# EAGLE design expansion_module_microSD (EAGLE 9.6.2)
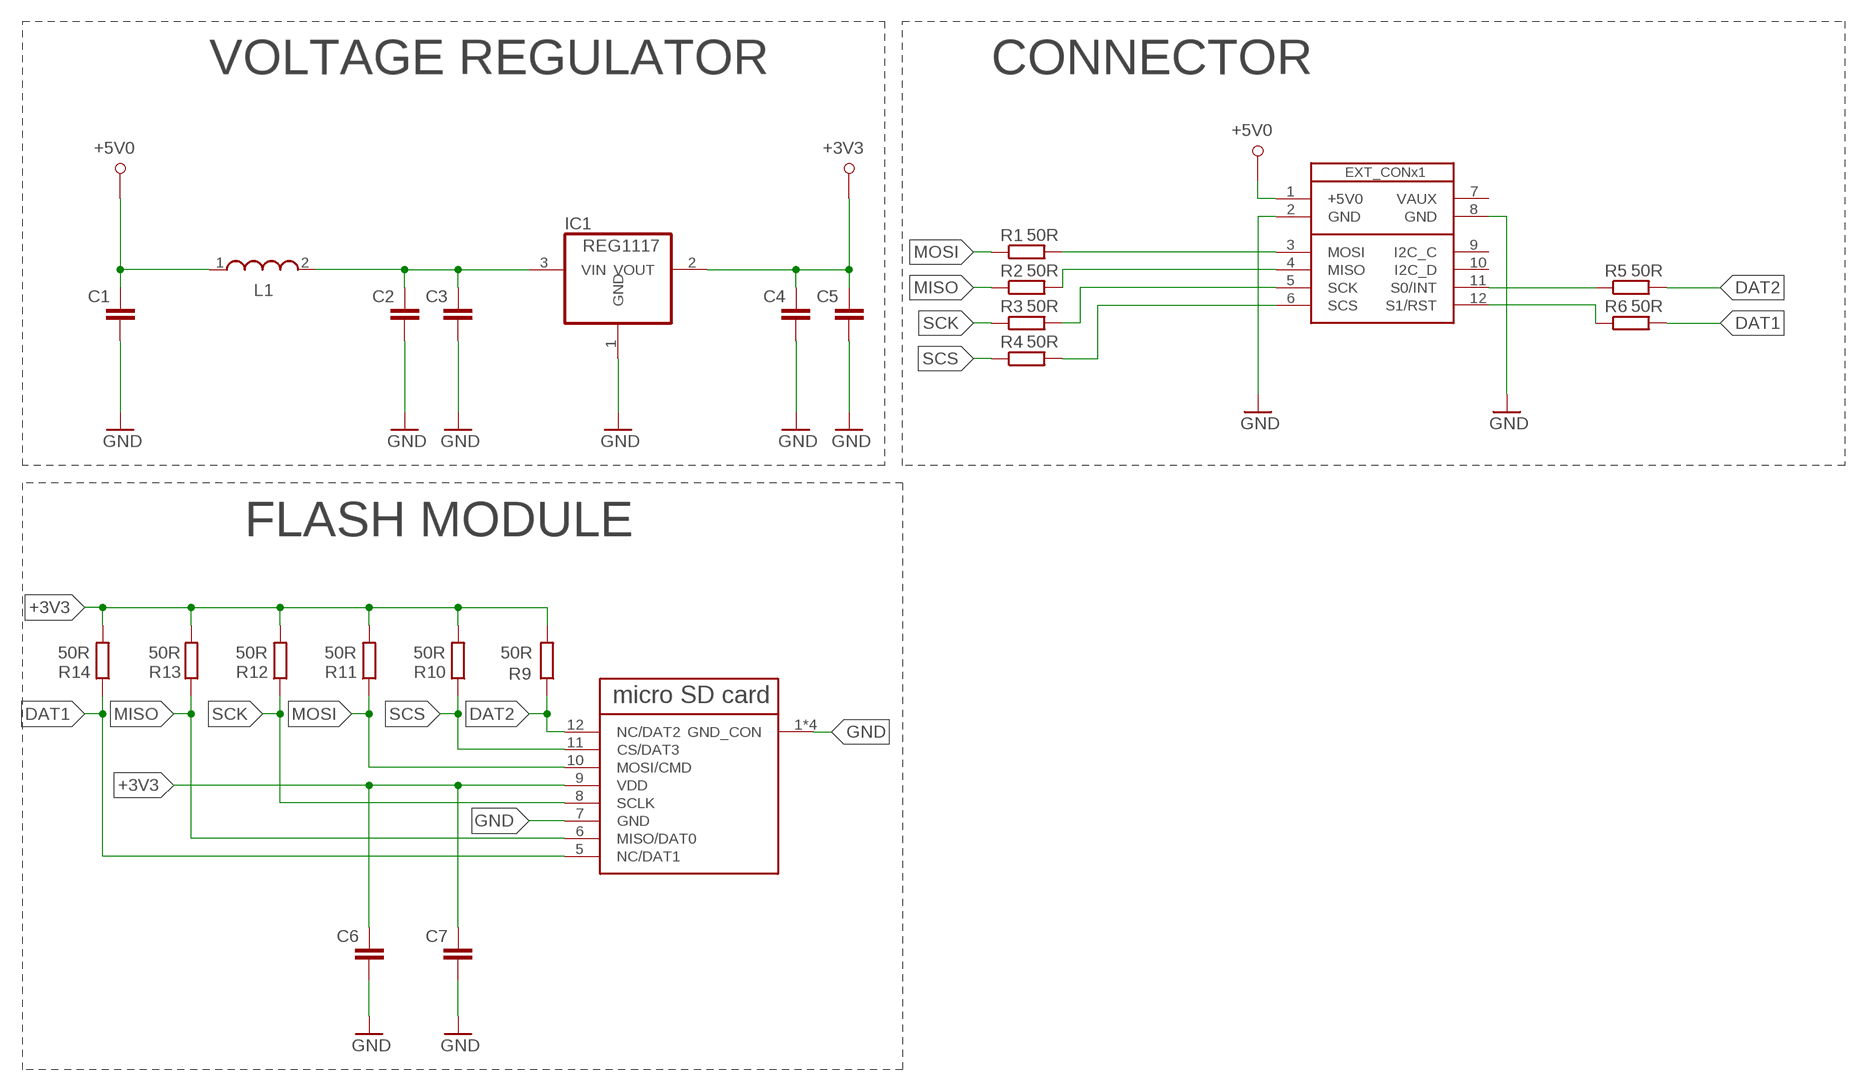
[diagram p0: schematic, sheet 1]

## Parts
C1  C-EUC0805  [C0805]
C2  C-EUC0805  [C0805]
C3  C-EUC0805  [C0805]
C4  C-EUC0805  [C0805]
C5  C-EUC0805  [C0805]
C6  C-EUC0805  [C0805]
C7  C-EUC0805  [C0805]
IC1  REG1117  [SOT223]
L1  WE-LQ_1210  [WE-LQ_M]
MICRO_SD_CARD  MX5009010801  [MX5009010801]
R1  50R  R-EU_R0805  [R0805]
R2  50R  R-EU_R0805  [R0805]
R3  50R  R-EU_R0805  [R0805]
R4  50R  R-EU_R0805  [R0805]
R5  50R  R-EU_R0805  [R0805]
R6  50R  R-EU_R0805  [R0805]
R9  50R  R-EU_R0805  [R0805]
R10  50R  R-EU_R0805  [R0805]
R11  50R  R-EU_R0805  [R0805]
R12  50R  R-EU_R0805  [R0805]
R13  50R  R-EU_R0805  [R0805]
R14  50R  R-EU_R0805  [R0805]
U$1  SB_EXT_CON_X1_SPI  [SB_EXT_CON_X1_FULL]

## Nets
+3V3: C4.2 C5.2 C6.2 C7.2 IC1.2(VOUT) MICRO_SD_CARD.9(VDD) R9.2 R10.2 R11.2 R12.2 R13.2 R14.2
+5V0: C1.2 L1.1 U$1.1(+5V0)
DAT1: MICRO_SD_CARD.5(NC/DAT1) R6.2 R14.1
DAT2: MICRO_SD_CARD.12(NC/DAT2) R5.2 R9.1
GND: C1.1 C2.1 C3.1 C4.1 C5.1 C6.1 C7.1 IC1.1(GND) MICRO_SD_CARD.1(GND_CON) MICRO_SD_CARD.2(GND_CON) MICRO_SD_CARD.3(GND_CON) MICRO_SD_CARD.4(GND_CON) MICRO_SD_CARD.7(GND) U$1.2(GND) U$1.8(GND)
MISO: MICRO_SD_CARD.6(MISO/DAT0) R2.1 R13.1
MOSI: MICRO_SD_CARD.10(MOSI/CMD) R1.1 R11.1
N$1: R1.2 U$1.3(MOSI)
N$2: R2.2 U$1.4(MISO)
N$3: R3.2 U$1.5(SCK)
N$4: R4.2 U$1.6(SCS)
N$5: R5.1 U$1.11(S0/INT)
N$6: R6.1 U$1.12(S1/RST)
N$8: C2.2 C3.2 IC1.3(VIN) L1.2
SCK: MICRO_SD_CARD.8(SCLK) R3.1 R12.1
SCS: MICRO_SD_CARD.11(CS/DAT3) R4.1 R10.1
Unconnected: U$1.7(VAUX) U$1.9(I2C_C) U$1.10(I2C_D)

## Notes on the sheet
- VOLTAGE REGULATOR | CONNECTOR
- FLASH MODULE

## Library data of the parts
C1-C7 = resistor:C-EU: CAPACITOR, European symbol
IC1 = burr-brown:REG1117: 800mA and 1A Low Dropout (LDO) Positive Regulator 1.8V, 2.5V, 2.85V, 3.3V, 5V, and Adj; MPN: REG1117; OC_FARNELL: 1097566; OC_NEWARK: 14P6981
L1 = EagleLibrary_Wuerth_Elektronik_eiSos_rev16a:WE-LQ: SMD Inductor Characteristics Miniature chip inductor wound on a special ferrite core Small inductances for compact circuits High Q at high frequencies Low DC-resistance Operating temperature: –40 ºC to +125 ºC Applications Low power DC/DC-converters from Linear Technology, National Semiconductor, Texas Instruments, Fairchild Semiconductor, ON Semiconductor, STMicroelectronics, Maxim, MPS, Semtech, Exar, Analogic Tech, Diodes and Cologne Chip EMI-Filtering RF-circuits <http://katalog.we-online.de/media/images/eisos/IndLQ_pf2.jpg> Details see: http://katalog.we-online.de/en/pbs/WE-LQ? Updated by Dan Xu 2014-07-08 2014 (C) Wurth Elektronik
MICRO_SD_CARD = micro_SD_card:MX5009010801
R1-R6 R9-R14 = resistor:R-EU_: RESISTOR, European symbol
U$1 = al_smartboard:SB_EXT_CON_X1_SPI

## Net classes
0 default: clearance 0.205 mm

## Board
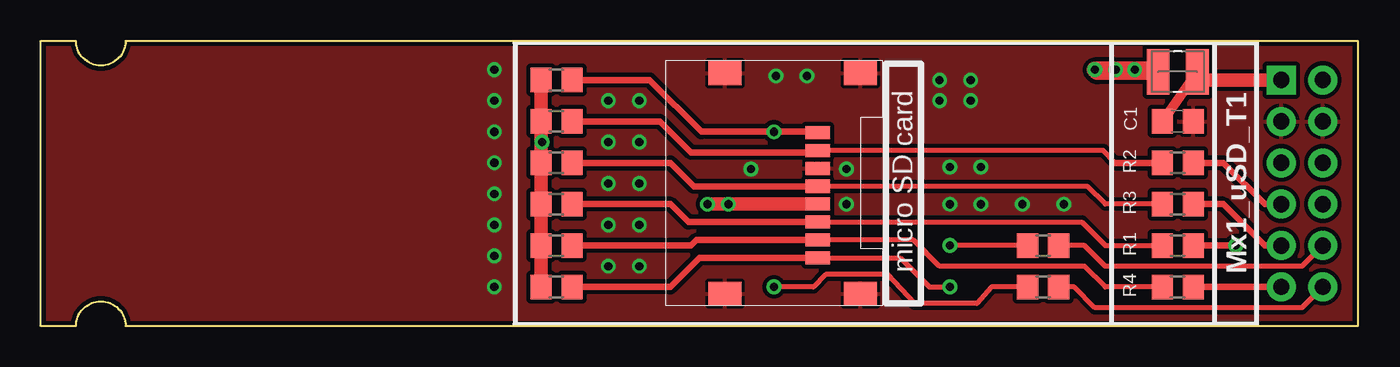
[diagram p1: board, top side]
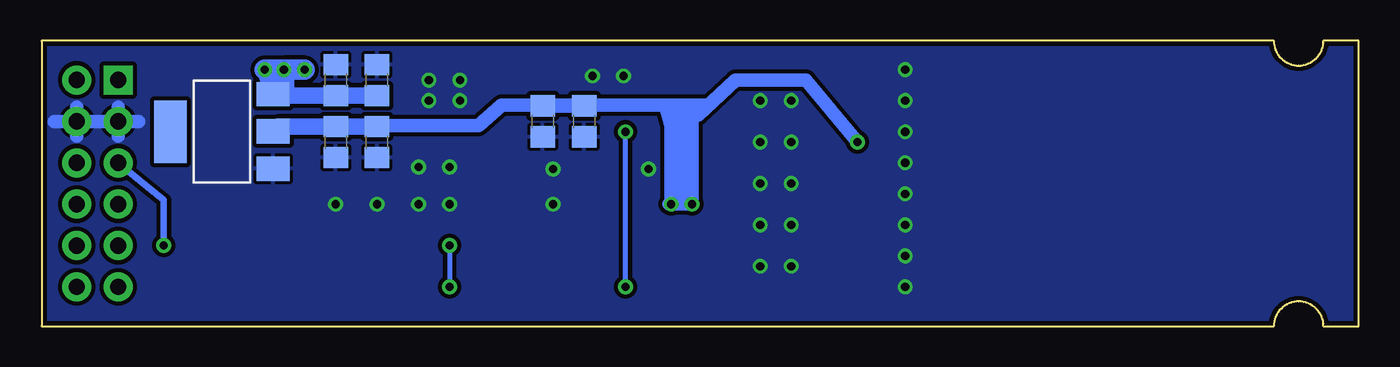
[diagram p2: board, bottom side, seen from below]

Size 80.77 x 17.53 mm. Coordinates in mm from the lower left corner, seen from the top.
Copper layers (1*16): Top 0.035mm / dielectric 1.5mm / Bottom 0.035mm
Design rules "default *": minimum track width 10mil, minimum drill 24mil, track to track 8mil, track to pad 8mil, pad to pad 8mil, via to via 8mil, smd to smd 8mil, copper to edge 10mil, drill to drill 20mil, minimum pad ring 10mil, minimum via ring 8mil, stop-mask expansion 4mil, vias tented up to drill 30mil, thermal gap 8mil

### Footprints (pad centres in the part's own frame; a part is rotated, then mirrored left to right if it is on the bottom)
C0805 = smd 1.3 x 1.5: 1 -0.95,0; 2 0.95,0
SOT223 = smd 1.499 x 2.007: 1 -2.261,-3.15; 2 0.025,-3.15; 3 2.311,-3.15 | smd 3.81 x 2.007: 4 0,3.15
WE-LQ_M = smd 1.4 x 2.8: 1 -1.2,0; 2 1.2,0
MX5009010801 = smd 1.45 x 2: 1 -6.77,5.31; 2 -6.77,-3; 3 6.77,-3; 4 6.77,5.31 | smd 0.8 x 1.5: 5 -3.13,2.7; 6 -2.03,2.7; 7 -0.93,2.7; 8 0.17,2.7; 9 1.27,2.7; 10 2.37,2.7; 11 3.47,2.7; 12 4.57,2.7
R0805 = smd 1.3 x 1.5: 1 -0.95,0; 2 0.95,0
SB_EXT_CON_X1_FULL = drill 1 pad 1.778 square: 1 15.24,5.08 | drill 1 pad 1.778: 2 12.7,5.08; 3 10.16,5.08; 4 7.62,5.08; 5 5.08,5.08; 6 2.54,5.08; 7 15.24,2.54; 8 12.7,2.54; 9 10.16,2.54; 10 7.62,2.54; 11 5.08,2.54; 12 2.54,2.54

### Placement (x,y rotation side)
C1  69.72,12.57 180 top
C2  62.74,15.11 270 bottom
C3  60.2,15.11 270 bottom
C4  62.74,11.3 90 bottom
C5  60.2,11.3 90 bottom
C6  50.04,12.57 90 bottom
C7  47.5,12.57 90 bottom
IC1  69.72,11.94 90 bottom
L1  69.72,15.62 180 top
MICRO_SD_CARD  44.96,8.76 270 top
R1  69.72,4.95 0 top
R2  69.72,10.03 0 top
R3  69.72,7.49 0 top
R4  69.72,2.41 0 top
R5  61.47,4.95 180 top
R6  61.47,2.41 180 top
R9  31.62,2.41 180 top
R10  31.62,4.95 180 top
R11  31.62,7.49 180 top
R12  31.62,10.03 180 top
R13  31.62,12.57 180 top
R14  31.62,15.11 180 top
U$1  81.15,-0.13 90 top

### Tracks (layer width: path | path; a pad name or v marks a point on that pad's centre or on a via)
+3V3  (via drill 0.5)
  Top 0.813: R14.2 R13.2 | R13.2 R12.2 R11.2 R10.2 R9.2 | R13.2 30.67,11.36 v30.73,11.3 | MICRO_SD_CARD.9 v42.16,7.49 v40.89,7.49
  Bottom 0.813: 41.53,12.89 40.89,12.89 v40.89,7.49 | 41.53,12.89 41.4,8.13 v40.89,7.49 | 41.91,7.49 41.91,12.25 42.16,12.76 | 42.16,12.76 v42.16,7.49 | 42.29,7.49 v42.16,7.49 | v40.89,7.49 v42.16,7.49 | 42.16,12.76 42.23,12.51 42.55,13.59 | 52.58,13.59 53.97,12.32 60.77,12.32 60.83,12.25 | 41.53,12.89 42.16,12.76 | 42.55,13.59 39.88,13.59 40.51,12.95 38.23,15.11 33.91,15.11 v30.73,11.3 | 41.15,13.27 41.53,12.89 | 52.58,13.59 42.55,13.59 | 52.58,13.59 50.1,13.59 C6.2 C7.2
  Bottom 1.016: C5.2 60.83,12.25 C4.2 66.28,12.25 IC1.2
+5V0
  Top 0.61: L1.1 C1.2
  Top 0.813: U$1.1 71.43,15.11 L1.1
DAT1  (via drill 0.5)
  Top 0.305: R6.2 58.29,2.41 57.4,1.4 53.59,1.4 51.94,3.17 48.13,3.17 47.37,2.41 v44.96,2.41
  Top 0.406: MICRO_SD_CARD.5 47.61,11.94 v44.96,11.94 40.51,11.94 37.34,15.11 R14.1
  Bottom 0.305: v44.96,2.41 v44.96,11.94
DAT2  (via drill 0.5)
  Top 0.305: R5.2 v55.75,4.95 | MICRO_SD_CARD.12 52.7,4.19 54.48,2.41 v55.75,2.41
  Top 0.406: MICRO_SD_CARD.12 | MICRO_SD_CARD.12 | MICRO_SD_CARD.12 40.39,4.19 38.61,2.41 R9.1
  Bottom 0.305: v55.75,4.95 v55.75,2.41
GND  (via drill 0.5)
  Bottom 0.813: 76.07,13.46 76.07,11.68 | 80.01,12.57 74.8,12.57 | 78.61,13.46 78.61,11.68
  other vias: 34.8,8.76 36.7,8.76 34.8,6.22 36.7,6.22 34.8,3.68 36.7,3.68 34.8,11.3 36.7,11.3 45.09,15.37 46.99,15.37 49.4,7.49 55.75,7.49 60.2,7.49 62.74,7.49 57.66,7.49 55.12,15.11 57.02,15.11 55.12,13.84 57.02,13.84 27.81,15.75 27.81,13.84 27.81,11.94 27.81,10.03 27.81,8.13 27.81,6.22 27.81,4.32 27.81,2.41 34.8,13.84 36.7,13.84 49.4,9.65 55.75,9.78 57.66,9.78 43.56,9.65
  pour Bottom (isolate 0.254): -0.13,17.65 81.15,17.91 81.15,-0.13 -0.13,-0.13
  pour Top (isolate 0.254): -0.13,17.65 81.15,17.65 81.15,-0.13 -0.13,-0.13
MISO
  Top 0.305: 65.91,10.03 65.15,10.79 MICRO_SD_CARD.6
  Top 0.406: 65.91,10.03 R2.1 | MICRO_SD_CARD.6 47.53,10.67 39.88,10.67 37.97,12.57 R13.1
MOSI
  Top 0.305: R1.1 65.28,4.95 63.84,6.39 MICRO_SD_CARD.10
  Top 0.406: 68.71,5.02 R1.1 | 47.57,6.48 MICRO_SD_CARD.10 39.71,6.39 38.61,7.49 R11.1
N$1  (via drill 0.5)
  Top 0.406: R1.2 v73.28,4.95
  Bottom 0.406: U$1.3 73.28,7.75 v73.28,4.95
N$2
  Top 0.406: U$1.4 75.06,7.49 72.52,10.03 R2.2
N$3
  Top 0.406: U$1.5 75.06,4.95 72.52,7.49 R3.2
N$4
  Top 0.406: U$1.6 R4.2
N$5
  Top 0.305: U$1.11 77.34,3.68 65.28,3.68 64.01,4.95 R5.1
N$6
  Top 0.305: U$1.12 77.34,1.14 64.64,1.14 63.37,2.41 R6.1
N$8  (via drill 0.5)
  Top 1.016: L1.2 64.77,15.62 v64.64,15.75 v65.91,15.75 68.45,15.75
  Bottom 1.016: v67.08,15.75 66.55,14.28 IC1.3 66.49,14.16 C2.2 C3.2
  Bottom 1.27: v64.64,15.75 v65.91,15.75 | v67.08,15.75 v65.91,15.75 | v65.91,15.75 65.91,14.48
SCK
  Top 0.305: R3.1 65.28,7.49 64.18,8.59 MICRO_SD_CARD.8
  Top 0.406: 69.09,7.49 R3.1 | R12.1 38.61,10.03 40.05,8.59 MICRO_SD_CARD.8
SCS
  Top 0.305: R4.1 65.28,2.41 64.01,3.68 55.12,3.68 53.51,5.29 MICRO_SD_CARD.11
  Top 0.406: 47.62,5.33 MICRO_SD_CARD.11 40.22,5.29 39.88,4.95 R10.1

### Text on the board
tPlace: Mx1_uSD_T1 | micro SD card